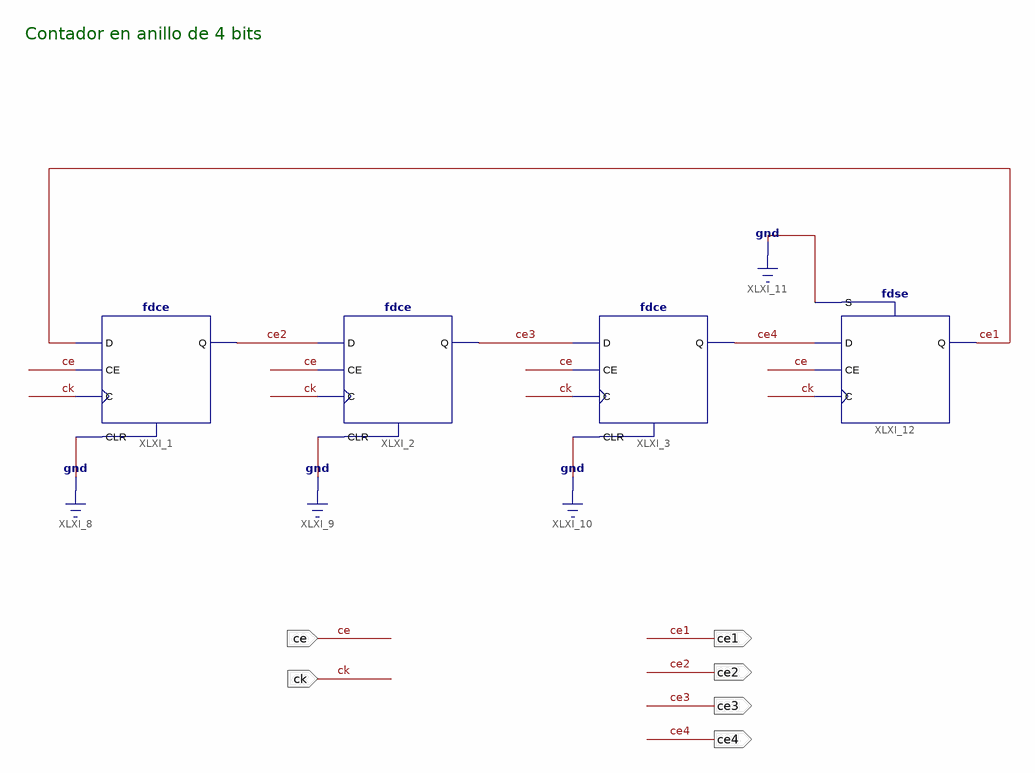
[diagram p0: schematic sheet 1]
// Xilinx ISE schematic cont_anillo_ce.sch (spartan3e) as structural Verilog: 4 symbols, 6 ports
module cont_anillo_ce (
  input  ck,
  input  ce,
  output ce4,
  output ce3,
  output ce2,
  output ce1
);

  fdce XLXI_1 (.C(ck), .CE(ce), .CLR(1'b0), .D(ce1), .Q(ce2));
  fdce XLXI_2 (.C(ck), .CE(ce), .CLR(1'b0), .D(ce2), .Q(ce3));
  fdce XLXI_3 (.C(ck), .CE(ce), .CLR(1'b0), .D(ce3), .Q(ce4));
  fdse XLXI_12 (.C(ck), .CE(ce), .D(ce4), .S(1'b0), .Q(ce1));

  // Notes on the sheet:
  //   Contador en anillo de 4 bits
endmodule
